# EAGLE design motor_board_headers (EAGLE 8.3.1)
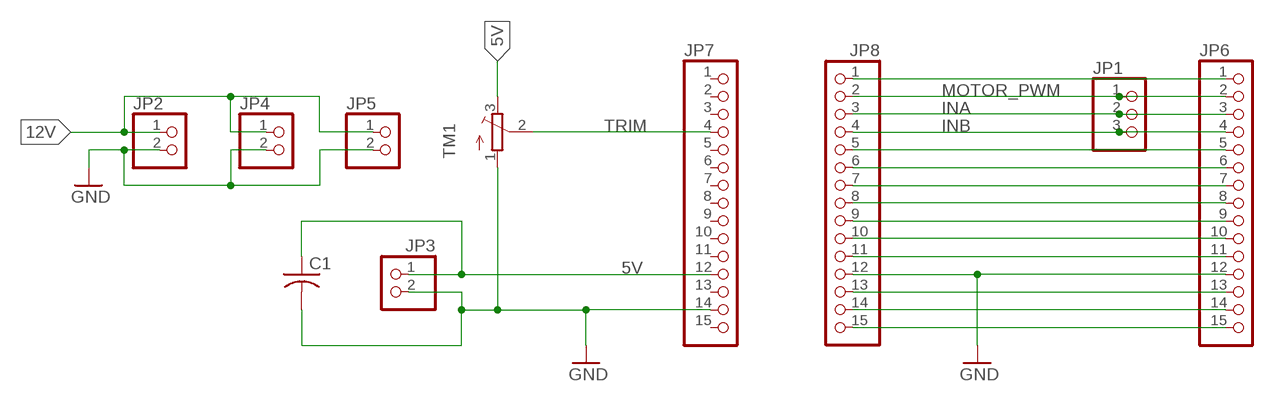
[diagram p0: schematic, sheet 1]

## Parts
C1  C-US025-060X050  [C025-060X050]
JP1  PINHD-1X3  [1X03]
JP2  PINHD-1X2  [1X02]
JP3  PINHD-1X2  [1X02]
JP4  PINHD-1X2  [1X02]
JP5  PINHD-1X2  [1X02]
JP6  PINHD-1X15  [1X15]
JP7  PINHD-1X15  [1X15]
JP8  PINHD-1X15  [1X15]
TM1  TRIMPOT3386  [TRIM-3386]

## Nets
5V: C1.1 JP3.1 JP7.12 TM1.3(E)
12V: JP2.1 JP4.1 JP5.1
GND: C1.2 JP2.2 JP3.2 JP4.2 JP5.2 JP6.12 JP7.14 JP8.12 TM1.1(A)
INA: JP1.2 JP6.3 JP8.3
INB: JP1.3 JP6.4 JP8.4
MOTOR_PWM: JP1.1 JP6.2 JP8.2
N$1: JP6.1 JP8.1
N$2: JP6.5 JP8.5
N$3: JP6.6 JP8.6
N$4: JP6.7 JP8.7
N$5: JP6.8 JP8.8
N$6: JP6.9 JP8.9
N$7: JP6.10 JP8.10
N$8: JP6.11 JP8.11
N$9: JP6.13 JP8.13
N$10: JP6.14 JP8.14
N$11: JP6.15 JP8.15
TRIM: JP7.4 TM1.2(S)
Unconnected: JP7.1 JP7.2 JP7.3 JP7.5 JP7.6 JP7.7 JP7.8 JP7.9 JP7.10 JP7.11 JP7.13 JP7.15

## Library data of the parts
C1 = adafruit:C-US: CAPACITOR, American symbol
JP1 = pinhead:PINHD-1X3: PIN HEADER
JP2-JP5 = pinhead:PINHD-1X2: PIN HEADER
JP6-JP8 = pinhead:PINHD-1X15: PIN HEADER
TM1 = adafruit:TRIMPOT: SMT trimmer potentiometer part number TC33X http://www.ladyada.net/library/eagle

## Board
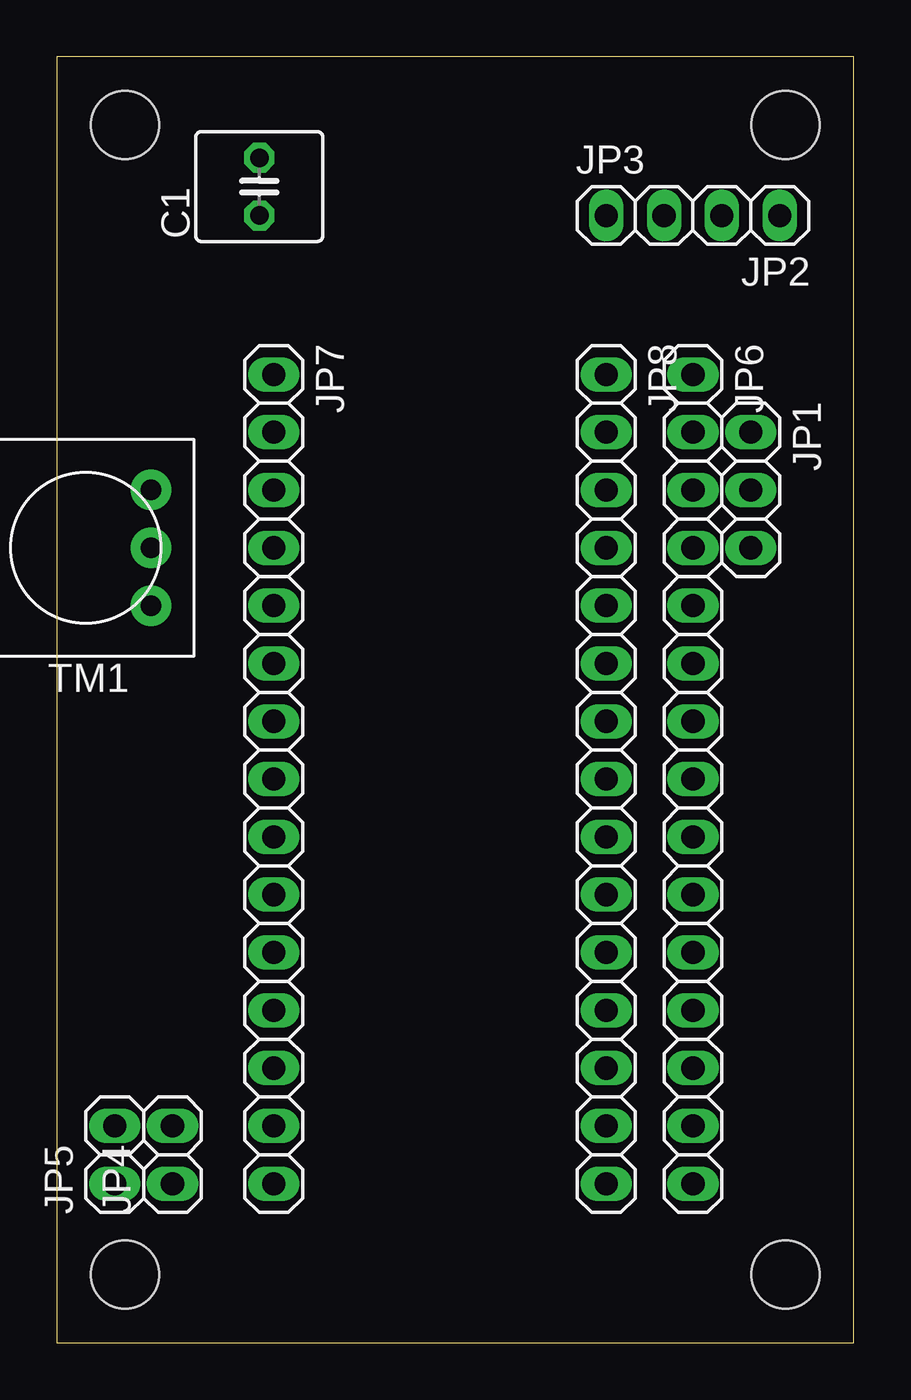
[diagram p1: board, top side]
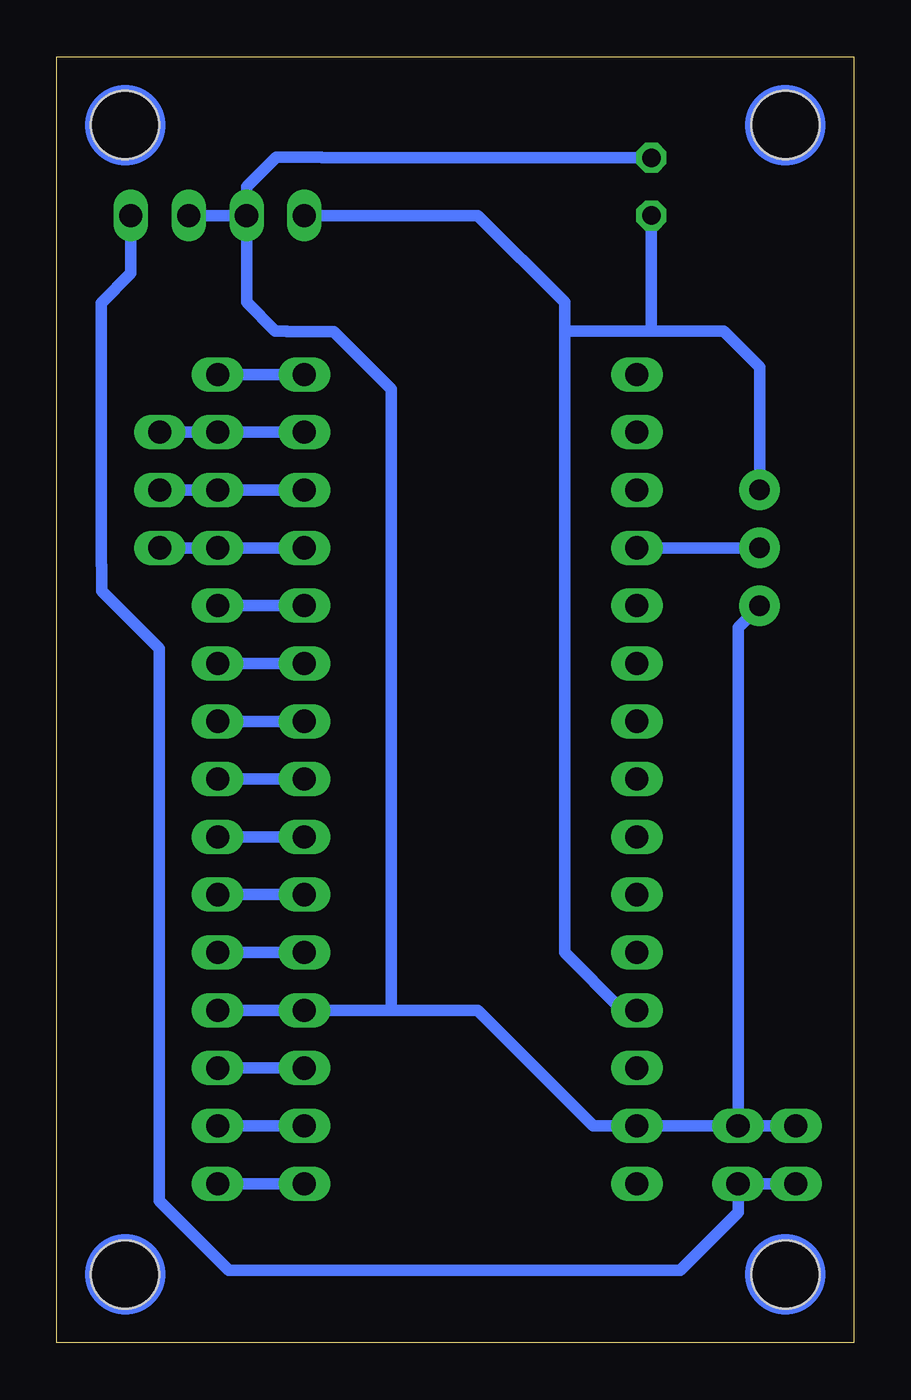
[diagram p2: board, bottom side, seen from below]

Size 35 x 56.5 mm. Coordinates in mm from the lower left corner, seen from the top.
Outline: 0,0 35,0 35,56.5 0,56.5 0,0
Copper layers (1*16): Top 0.035mm / dielectric 1.5mm / Bottom 0.035mm
Design rules "OthermillDRC_1_32_v2": minimum track width 8mil, minimum drill 0.8mm, track to track 0.794003125mm, track to pad 0.794003125mm, pad to pad 0.794003125mm, via to via 0.794003125mm, smd to smd 0mil, copper to edge 0mil, drill to drill 1mil, minimum pad ring 10mil, minimum via ring 10mil, stop-mask expansion 1mil, vias tented up to drill 30mil, thermal gap 10mil
Holes 3 mm at 3,3 32,3 32,53.5 3,53.5

### Footprints (pad centres in the part's own frame; a part is rotated, then mirrored left to right if it is on the bottom)
C025-060X050 = drill 0.813 octagon: 1 -1.27,0; 2 1.27,0
1X03 = drill 1.016 long: 1 -2.54,0; 2 0,0; 3 2.54,0
1X02 = drill 1.016 long: 1 -1.27,0; 2 1.27,0
1X15 = drill 1.016 long: 1 -17.78,0; 2 -15.24,0; 3 -12.7,0; 4 -10.16,0; 5 -7.62,0; 6 -5.08,0; 7 -2.54,0; 8 0,0; 9 2.54,0; 10 5.08,0; 11 7.62,0; 12 10.16,0; 13 12.7,0; 14 15.24,0; 15 17.78,0
TRIM-3386 = drill 0.9 pad 1.778: 1 -2.54,-2.857; 2 0,-2.857; 3 2.54,-2.857

### Placement (x,y rotation side)
C1  8.89,50.8 90 top
JP1  30.48,37.47 270 top
JP2  30.48,49.53 180 top
JP3  25.4,49.53 0 top
JP4  5.08,8.26 90 top
JP5  2.54,8.26 90 top
JP6  27.94,24.77 270 top
JP7  9.53,24.77 270 top
JP8  24.13,24.77 270 top
TM1  1.27,34.92 90 top

### Tracks (layer width: path | path; a pad name or v marks a point on that pad's centre or on a via)
5V
  Bottom 0.508: TM1.3 4.13,42.86 5.71,44.45 8.87,44.45 | 8.87,44.45 12.67,44.45 | 12.67,44.45 12.68,44.45 12.7,44.43 12.7,17.14 10.16,14.61 JP7.12 | JP3.1 16.51,49.53 12.7,45.72 12.7,44.48 12.67,44.45 | C1.1 8.89,44.47 8.87,44.45
12V
  Bottom 0.508: JP5.1 JP4.1 5.08,5.71 7.62,3.17 27.45,3.17 30.51,6.24 30.51,30.51 33.02,33.02 33.02,34.14 33.05,34.17 33.05,45.69 31.75,46.99 JP2.1
GND
  Bottom 0.508: JP4.2 5.08,31.43 TM1.1 | 20.47,14.61 16.51,14.61 11.43,9.53 JP7.14 JP4.2 | 20.47,14.61 20.32,14.76 20.32,41.91 22.83,44.42 24.88,44.42 24.91,44.45 25.4,44.45 26.67,45.72 JP3.2 26.81,49.53 | C1.2 23.35,52.07 23.38,52.1 25.37,52.1 26.67,50.8 26.67,49.67 26.81,49.53 | JP2.2 26.81,49.53 | JP4.2 JP5.2 | JP6.12 JP8.12 20.47,14.61
INA
  Bottom 0.508: JP1.2 JP6.3 JP8.3
INB
  Bottom 0.508: JP1.3 JP6.4 JP8.4
MOTOR_PWM
  Bottom 0.508: JP1.1 JP6.2 JP8.2
N$1
  Bottom 0.508: JP8.1 JP6.1
N$2
  Bottom 0.508: JP8.5 JP6.5
N$3
  Bottom 0.508: JP8.6 JP6.6
N$4
  Bottom 0.508: JP8.7 JP6.7
N$5
  Bottom 0.508: JP8.8 JP6.8
N$6
  Bottom 0.508: JP8.9 JP6.9
N$7
  Bottom 0.508: JP8.10 JP6.10
N$8
  Bottom 0.508: JP8.11 JP6.11
N$9
  Bottom 0.508: JP8.13 JP6.13
N$10
  Bottom 0.508: JP8.14 JP6.14
N$11
  Bottom 0.508: JP8.15 JP6.15
TRIM
  Bottom 0.508: JP7.4 TM1.2
(copper drawn outside any net)
  shapes: Bottom circle x4